# Altium schematic sheet FTDI2.SchDoc
size B
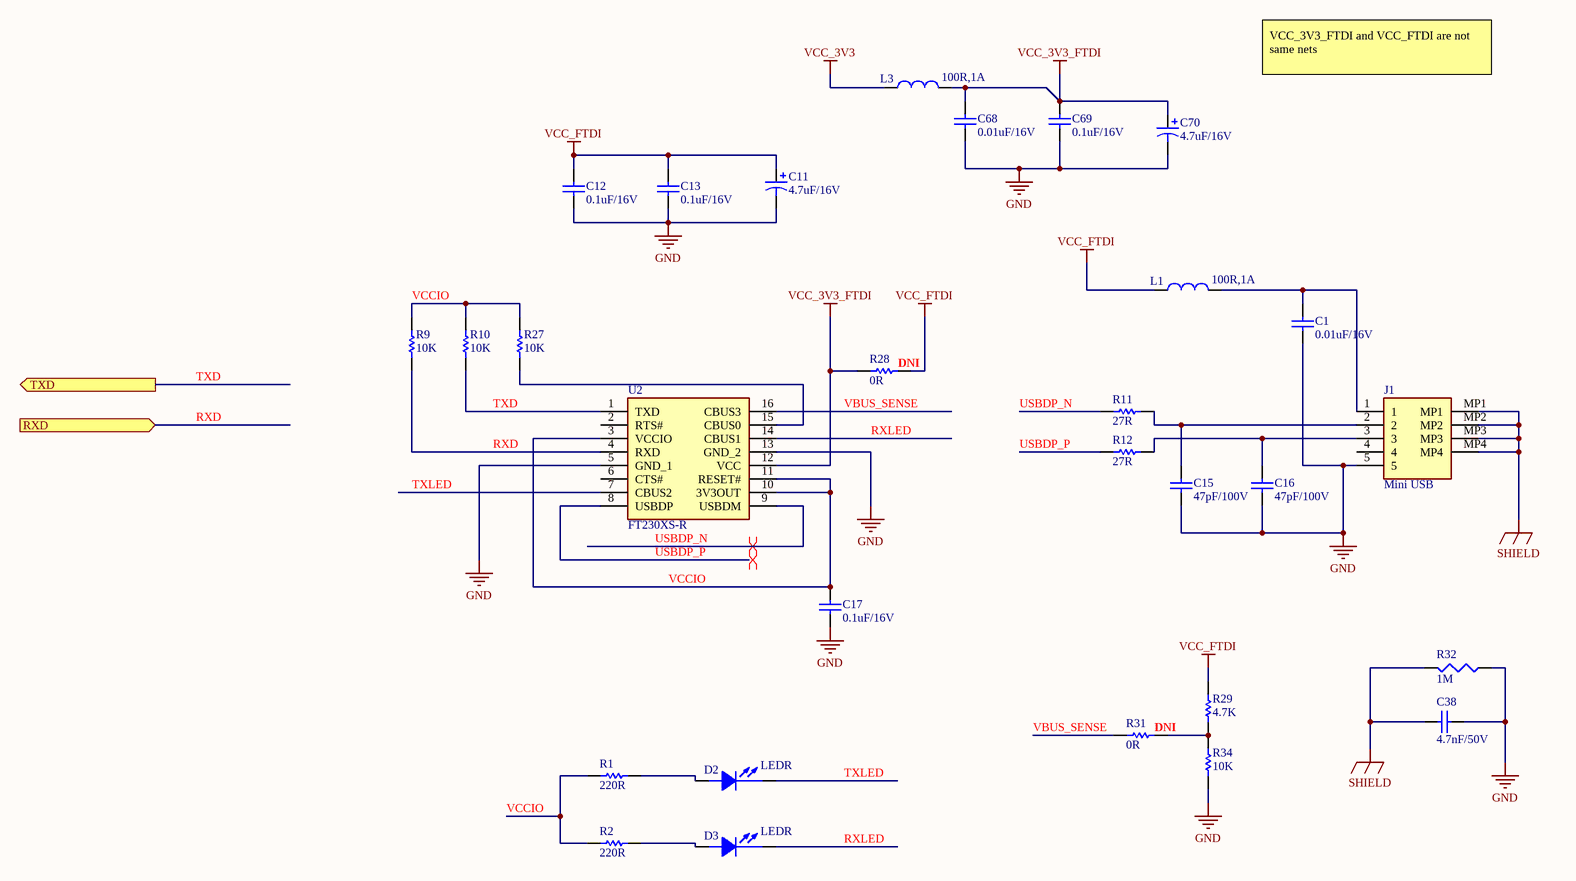
[diagram p0: FTDI2.SchDoc]

## Parts
C1  0.01uF/16V  [0603C]
C11  4.7uF/16V
C12  0.1uF/16V  [0603C]
C13  0.1uF/16V  [0603C]
C15  47pF/100V  [0603C]
C16  47pF/100V  [0603C]
C17  0.1uF/16V  [0603C]
C38  4.7nF/50V  [0603C]
C68  0.01uF/16V  [0603C]
C69  0.1uF/16V  [0603C]
C70  4.7uF/16V
D2  LEDR  [LED_0603]
D3  LEDR  [LED_0603]
J1  Mini USB
L1  100R,1A  [0603L]
L3  100R,1A  [0603L]
R1  220R  [0603R]
R2  220R  [0603R]
R9  10K  [0603R]
R10  10K  [0603R]
R11  27R  [0603R]
R12  27R  [0603R]
R27  10K  [0603R]
R28  0R  [AXIAL-0.3]
R29  4.7K  [0603R]
R31  0R  [AXIAL-0.3]
R32  1M  [0603R]
R34  10K  [0603R]
U2  FT230XS-R

## Ports
RXD (in), TXD (out)

## Nets
GND: C1.2 C11.2 C12.1 C13.1 C15.1 C16.1 C17.1 C38.1 C68.2 C69.2 C70.2 J1.5 R32.2 R34.2 U2.5(GND_1) U2.13(GND_2)
SHIELD: C38.2 J1.MP1 J1.MP2 J1.MP3 J1.MP4 R32.1
VCC_3V3: L3.1
VCC_3V3_FTDI: C68.1 C69.1 C70.1 L3.2 R28.1 U2.12(VCC)
VCC_FTDI: C11.1 C12.2 C13.2 L1.1 R28.2 R29.2
RXD: R9.2 U2.4(RXD) ; port RXD
RXLED: D3.2(CATHODE) U2.14(CBUS1)
TXD: R10.2 U2.1(TXD) ; port TXD
TXLED: D2.2(CATHODE) U2.7(CBUS2)
USBDP_N: R11.2 U2.9(USBDM)
USBDP_P: R12.2 U2.8(USBDP)
VBUS_SENSE: R31.1 U2.16(CBUS3)
VCCIO: C17.2 R1.2 R2.2 R9.1 R10.1 R27.1 U2.3(VCCIO) U2.10(3V3OUT) U2.11(RESET#)
NetC1_1: C1.1 J1.1 L1.2
NetC15_2: C15.2 J1.2 R11.1
NetC16_2: C16.2 J1.3 R12.1
NetD2_1: D2.1(ANODE) R1.1
NetD3_1: D3.1(ANODE) R2.1
NetR27_2: R27.2 U2.15(CBUS0)
NetR29_1: R29.1 R31.2 R34.1

Not connected (* = marked no-connect by the designer): J1 4; U2 2(RTS#) 6(CTS#)

## Layout directives
differential pair: USBDP_N, USBDP_P

## Notes on the sheet
- VCC_3V3_FTDI and VCC_FTDI are not same nets
- (near R28) DNI
- (near R31) DNI

## Library data of the parts
C1 C68 = Cap: Multilayer Ceramic Capacitors MLCC - SMD/SMT 16V 0.01uF X7R 0603 10% AEC-Q200; Mfr: KEMET; Mfr Part No: C0603C103K4RECAUTO; Package: 0603; Price: 0.151; Stockiest: MOUSER; Stockiest Part No: 80-C0603C103K4RECAUT; Value: 0.01uF/16V
C11 C70 = Cap Pol1: Tantalum Capacitors - Solid SMD 16V 4.7uF 1206; Mfr: KEMET; Mfr Part No: T495A475K016ATA2K0; Value: 4.7uF/16V; Package: 1206; Price: 1.83; Stockiest: MOUSER; Stockiest Part No: 80-T495A475K16ATA2K0
C12 C13 C17 = Cap: Multilayer Ceramic Capacitors MLCC - SMD/SMT 0603 16VDC 0.1uF 10% X7R AEC-Q2000; Mfr: Taiyo Yuden; Mfr Part No: EMK107B7104KAHT; Value: 0.1uF/16V; Package: 0603; Price: 0.101; Stockiest: MOUSER; Stockiest Part No: 963-EMK107B7104KAHT
C15 C16 = Cap: Multilayer Ceramic Capacitors MLCC - SMD/SMT 100V 47pF 0603 X8R 20% AEC-Q200; Mfr: KEMET; Mfr Part No: C0603C470M1HACAUTO; Value: 47pF/100V; Package: 0603; Price: 0.121; Stockiest: MOUSER; Stockiest Part No: 80-C0603C470M1HAUTO
C38 = 0805_CAP: Multilayer Ceramic Capacitors MLCC - SMD/SMT 50V 4700pF X7R 0603 10% AEC-Q200; Mfr Part No: C0603C472K5RACAUTO7411; Mfr: KEMET; Price: 0.221; Stockiest: MOUSER; Stockiest Part No: 80-C0603C472K5RAUTLR; Value: 4.7nF/50V; Package: 0603
C69 = Cap: Multilayer Ceramic Capacitors MLCC - SMD/SMT 0603 16VDC 0.1uF 10% X7R AEC-Q200; Mfr: Taiyo Yuden; Mfr Part No: EMK107B7104KAHT; Package: 0603; Price: 0.101; Stockiest: MOUSER; Stockiest Part No: 963-EMK107B7104KAHT; Value: 0.1uF/16V
D2 D3 = LED: Standard LEDs - SMD Red 631nm 14mcd 5mA; Mfr Part No: LTST-C193KRKT-5A; Package: 0603; Price: 0.28; Stockiest Part No: 859-LTSTC193KRKT5A; Value: RED; Stockiest: MOUSER
J1 = 10033527-N3112LF: USB Connectors M-USB 1X1 B/REC R/A SMT; Mfr: TE Connectivity; Mfr Part No: 1734035-2; Price: 1.59; Stockiest: MOUSER; Stockiest Part No: 571-1734035-2
L1 L3 = 0805_IND: Ferrite Beads 100ohms 1A 60mOhms 0603 Ferrite Chip; Mfr: TDK; Mfr Part No: MPZ1608D101BTA00; Value: 100R/1A; Package: 0603; Price: 0.10; Stockiest: MOUSER; Stockiest Part No: 810-MPZ1608D101BTA00
R1 R2 = Res1: Thick Film Resistors - SMD 1/10Watt 220ohms 5% Commercial Use; Mfr: Vishay / Dale; Mfr Part No: CRCW0603220RJNEAC; Package: 0603; Price: 0.101; Stockiest: MOUSER; Stockiest Part No: 71-CRCW0603220RJNEAC; Value: 220R
R9 R10 R27 R34 = Res1: Thick Film Resistors - SMD 0603 10Kohms 1% Anti-Sulfur AEC-Q200; Mfr: ROHM Semiconductor; Mfr Part No: SFR03EZPF1002; Value: 10K; Package: 0603; Price: 0.101; Stockiest: MOUSER; Stockiest Part No: 755-SFR03EZPF1002
R11 R12 = Res1: Thick Film Resistors - SMD 0603 0.25W 1% 27ohm AEC-Q200; Mfr: Panasonic; Mfr Part No: ERJ-UP3F27R0V; Value: 27R; Package: 0603; Price: 0.262; Stockiest: MOUSER; Stockiest Part No: 667-ERJ-UP3F27R0V
R28 R31 = Res1: Thick Film Resistors - SMD 1/10Watt 0ohms Commercial Use; Mfr: Vishay / Dale; Mfr Part No: CRCW06030000Z0EAC; Value: 0R; Package: 0603; Price: 0.101; Stockiest: MOUSER; Stockiest Part No: 71-CRCW06030000Z0EAC
R29 = Res1: Thick Film Resistors - SMD 1/10Watt 4.7Kohms 5% Commercial Use; Mfr: Vishay / Dale; Mfr Part No: CRCW06034K70JNEAC; Package: 0603; Price: 0.101; Stockiest: MOUSER; Stockiest Part No: 71-CRCW06034K70JNEAC; Value: 4.7K
R32 = 0805_RES: Thick Film Resistors - SMD 0603 0.25W 1% 1Mohm AEC-Q200; Mfr Part No: ERJ-UP3F1004V; Mfr: Panasonic; Price: 0.262; Stockiest: MOUSER; Stockiest Part No: 667-ERJ-UP3F1004V; Value: 1M; Package: 0603
U2 = FT230: USB Interface IC USB to Basic Serial UART IC SSOP-16; Mfr: FTDI; Mfr Part No: FT230XS-R; Price: 2.06; Stockiest: MOUSER; Stockiest Part No: 895-FT230XS-R